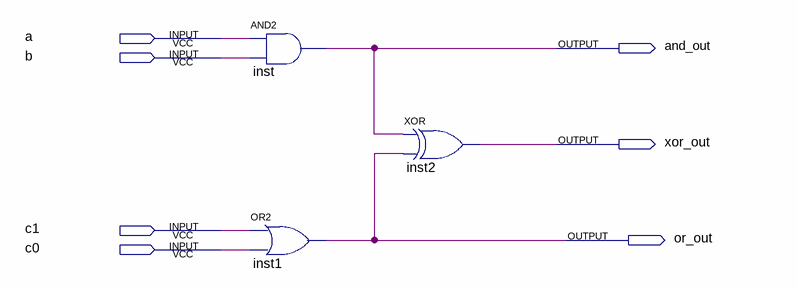
[diagram p0: schematic sheet]
// Quartus schematic example.bdf as structural Verilog: 3 symbols, 7 pins
module example (
  input  a,
  input  b,
  input  c1,
  input  c0,
  output and_out,
  output xor_out,
  output or_out
);

  and inst (and_out, a, b);
  or inst1 (or_out, c1, c0);
  xor inst2 (xor_out, and_out, or_out);
endmodule
